# Altium schematic sheet tc_tp5_ej1.SchDoc
size A
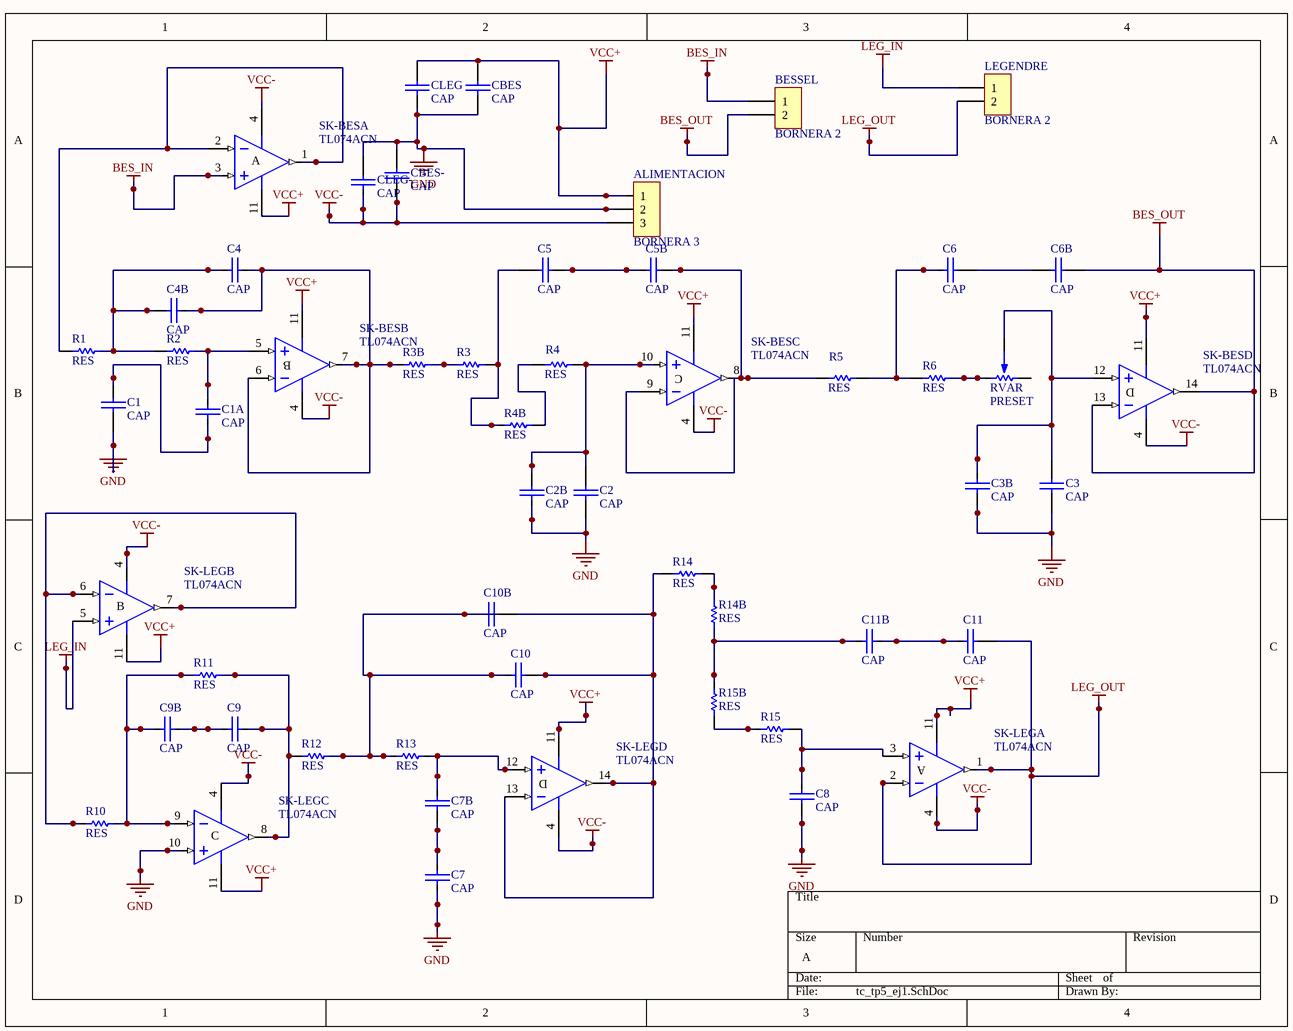
[diagram p0: tc_tp5_ej1.SchDoc]

## Parts
ALIMENTACION  BORNERA 3  [BORNERA3]
BESSEL  BORNERA 2  [BORNERA2]
C1  CAP  [CAP200]
C1A  CAP  [CAP200]
C2  CAP  [CAP200]
C2B  CAP  [CAP200]
C3  CAP  [CAP200]
C3B  CAP  [CAP200]
C4  CAP  [CAP200]
C4B  CAP  [CAP200]
C5  CAP  [CAP200]
C5B  CAP  [CAP200]
C6  CAP  [CAP200]
C6B  CAP  [CAP200]
C7  CAP  [CAP200]
C7B  CAP  [CAP200]
C8  CAP  [CAP200]
C9  CAP  [CAP200]
C9B  CAP  [CAP200]
C10  CAP  [CAP200]
C10B  CAP  [CAP200]
C11  CAP  [CAP200]
C11B  CAP  [CAP200]
CBES  CAP  [CAP200]
CBES-  CAP  [CAP200]
CLEG  CAP  [CAP200]
CLEG-  CAP  [CAP200]
LEGENDRE  BORNERA 2  [BORNERA2]
R1  RES  [0805]
R2  RES  [0805]
R3  RES  [0805]
R3B  RES  [0805]
R4  RES  [0805]
R4B  RES  [0805]
R5  RES  [0805]
R6  RES  [0805]
R10  RES  [0805]
R11  RES  [0805]
R12  RES  [0805]
R13  RES  [0805]
R14  RES  [0805]
R14B  RES  [0805]
R15  RES  [0805]
R15B  RES  [0805]
RVAR  PRESET  [PRESET H]
SK-BES  TL074ACN  [DIP14]  (parts A,B,C,D of 4)
SK-LEG  TL074ACN  [DIP14]  (parts A,B,C,D of 4)

## Nets
BES_IN: BESSEL.1 SK-BES.3(IN+)
BES_OUT: BESSEL.2 C6B.1 SK-BES.13(IN-) SK-BES.14(OUT)
GND: ALIMENTACION.2 C1.2 C2.2 C2B.2 C3.2 C3B.1 C7.1 C8.1 CBES.2 CBES-.1 CLEG.2 CLEG-.1 SK-LEG.10(IN+)
LEG_IN: LEGENDRE.1 SK-LEG.5(IN+)
LEG_OUT: C11.2 LEGENDRE.2 SK-LEG.1(OUT) SK-LEG.2(IN-)
VCC+: ALIMENTACION.1 CBES.1 CLEG.1 SK-BES.11(V-) SK-LEG.11(V-)
VCC-: ALIMENTACION.3 CBES-.2 CLEG-.2 SK-BES.4(V+) SK-LEG.4(V+)
NetC1_1: C1.1 C1A.1
NetC1A_2: C1A.2 R2.2 SK-BES.5(IN+)
NetC2_1: C2.1 C2B.1 R4.2 SK-BES.10(IN+)
NetC3_1: C3.1 C3B.2 RVAR.2 SK-BES.12(IN+)
NetC4_1: C4.1 C4B.2 R1.2 R2.1
NetC4_2: C4.2 C4B.1 R3B.1 SK-BES.6(IN-) SK-BES.7(OUT)
NetC5_1: C5.1 R3.2 R4B.1
NetC5_2: C5.2 C5B.1
NetC5B_2: C5B.2 R5.1 SK-BES.8(OUT) SK-BES.9(IN-)
NetC6_1: C6.1 R5.2 R6.1
NetC6_2: C6.2 C6B.2
NetC7_2: C7.2 C7B.1
NetC7B_2: C7B.2 R13.2 SK-LEG.12(IN+)
NetC8_2: C8.2 R15.2 SK-LEG.3(IN+)
NetC9_1: C9.1 C9B.2
NetC9_2: C9.2 R11.2 R12.1 SK-LEG.8(OUT)
NetC9B_1: C9B.1 R10.2 R11.1 SK-LEG.9(IN-)
NetC10_1: C10.1 C10B.1 R12.2 R13.1
NetC10_2: C10.2 C10B.2 R14.2 SK-LEG.13(IN-) SK-LEG.14(OUT)
NetC11_1: C11.1 C11B.1
NetC11B_2: C11B.2 R14B.1 R15B.1
NetR1_1: R1.1 SK-BES.1(OUT) SK-BES.2(IN-)
NetR3_1: R3.1 R3B.2
NetR4_1: R4.1 R4B.2
NetR6_2: R6.2 RVAR.1
NetR10_1: R10.1 SK-LEG.6(IN-) SK-LEG.7(OUT)
NetR14_1: R14.1 R14B.2
NetR15_1: R15.1 R15B.2

Not connected (* = marked no-connect by the designer): RVAR 3

## Notes on the sheet
- (in symbol TL074ACN, part A) A
- (in symbol TL074ACN, part B) B
- (in symbol TL074ACN, part C) C
- (in symbol TL074ACN, part D) D

## Library data of the parts
SK-BES SK-LEG = TL074ACN: Low-Noise J-FET Quad Operational Amplifier; Published: 24-Aug-2001; LatestRevisionDate: 06-Jun-2005; LatestRevisionNote: Stylized 3D Model Added.; DatasheetVersion: Dec-1998; PackageVersion: Jan-1997; PackageReference: DIP14; Publisher: Altium Limited; PackageDescription: DIP; 14 Leads; Row Spacing 7.62 mm; Pitch 2.54 mm; ComponentLink1Description: Manufacturer Link; ComponentLink1URL: http://www.st.com/; ComponentLink2Description: Datasheet; ComponentLink2URL: http://www.st.com/stonline/products/literature/ds/2297/tl074.pdf